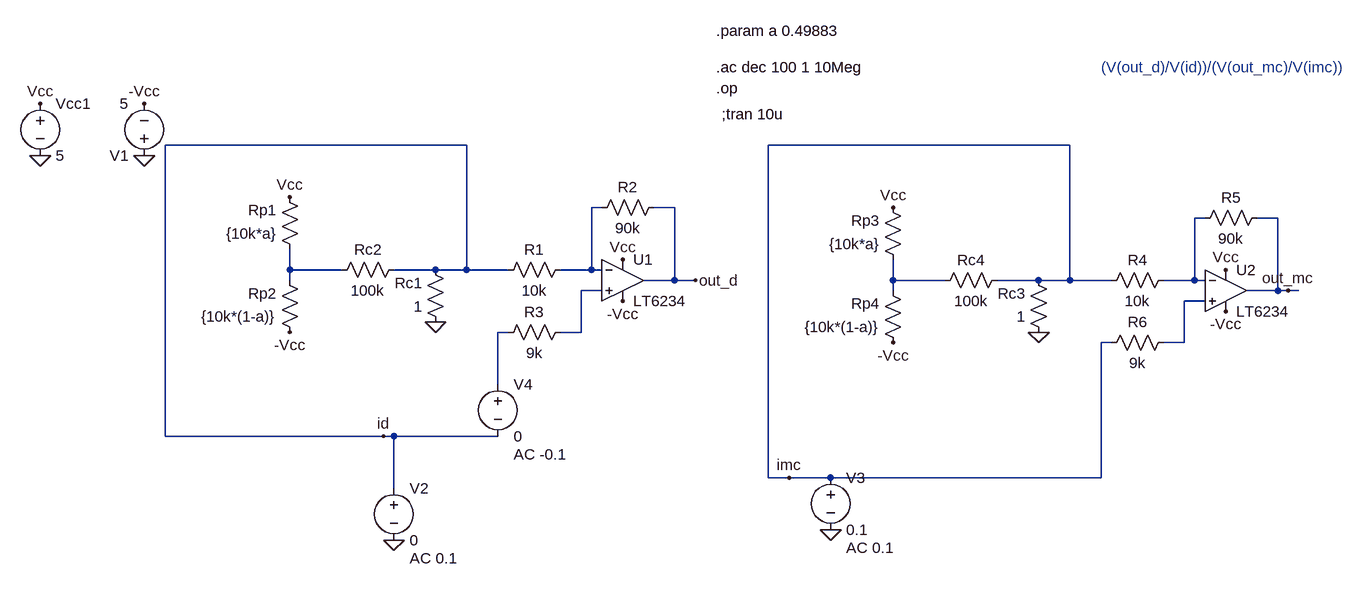
[diagram p0: schematic CMRR.asc]
CMRR.asc, the LTspice schematic file:
Version 4
SHEET 1 1748 796
WIRE 64 144 -400 144
WIRE 992 144 528 144
WIRE 272 240 256 240
WIRE 384 240 352 240
WIRE 1200 256 1184 256
WIRE 1312 256 1280 256
WIRE -208 336 -208 304
WIRE -128 336 -208 336
WIRE 16 336 -48 336
WIRE 64 336 64 144
WIRE 64 336 16 336
WIRE 128 336 64 336
WIRE 256 336 256 240
WIRE 256 336 208 336
WIRE 272 336 256 336
WIRE -208 352 -208 336
WIRE 384 352 384 240
WIRE 384 352 336 352
WIRE 416 352 384 352
WIRE 720 352 720 320
WIRE 800 352 720 352
WIRE 944 352 880 352
WIRE 992 352 992 144
WIRE 992 352 944 352
WIRE 1056 352 992 352
WIRE 1184 352 1184 256
WIRE 1184 352 1136 352
WIRE 1200 352 1184 352
WIRE 272 368 240 368
WIRE 720 368 720 352
WIRE 1312 368 1312 256
WIRE 1312 368 1264 368
WIRE 1328 368 1312 368
WIRE 1344 368 1328 368
WIRE 1200 384 1168 384
WIRE 128 432 112 432
WIRE 240 432 240 368
WIRE 240 432 208 432
WIRE 1056 448 1040 448
WIRE 1168 448 1168 384
WIRE 1168 448 1136 448
WIRE 112 512 112 432
WIRE -400 592 -400 144
WIRE -64 592 -400 592
WIRE -48 592 -64 592
WIRE 112 592 -48 592
WIRE 528 656 528 144
WIRE 560 656 528 656
WIRE 624 656 560 656
WIRE 1040 656 1040 448
WIRE 1040 656 624 656
WIRE -48 672 -48 592
FLAG -592 160 0
FLAG -432 160 0
FLAG -592 80 Vcc
FLAG -432 80 -Vcc
FLAG 304 320 Vcc
FLAG 304 384 -Vcc
FLAG 16 416 0
FLAG -208 224 Vcc
FLAG -208 432 -Vcc
FLAG 1232 336 Vcc
FLAG 1232 400 -Vcc
FLAG 944 432 0
FLAG 720 240 Vcc
FLAG 720 448 -Vcc
FLAG 1328 368 out_mc
FLAG 624 736 0
FLAG 560 656 imc
FLAG -48 752 0
FLAG 416 352 out_d
FLAG -64 592 id
SYMBOL voltage -592 64 R0
WINDOW 123 0 0 Left 0
WINDOW 39 0 0 Left 0
SYMATTR InstName Vcc1
SYMATTR Value 5
SYMBOL voltage -432 176 R180
WINDOW 123 0 0 Left 0
WINDOW 39 0 0 Left 0
SYMATTR InstName V1
SYMATTR Value 5
SYMBOL OpAmps\\LT6234 304 352 R0
SYMATTR InstName U1
SYMBOL res 224 320 R90
WINDOW 0 0 56 VBottom 2
WINDOW 3 32 56 VTop 2
SYMATTR InstName R1
SYMATTR Value 10k
SYMBOL res 368 224 R90
WINDOW 0 0 56 VBottom 2
WINDOW 3 32 56 VTop 2
SYMATTR InstName R2
SYMATTR Value 90k
SYMBOL res 224 416 R90
WINDOW 0 0 56 VBottom 2
WINDOW 3 32 56 VTop 2
SYMATTR InstName R3
SYMATTR Value 9k
SYMBOL res 32 432 R180
WINDOW 0 36 76 Left 2
WINDOW 3 36 40 Left 2
SYMATTR InstName Rc1
SYMATTR Value 1
SYMBOL res -32 320 R90
WINDOW 0 0 56 VBottom 2
WINDOW 3 32 56 VTop 2
SYMATTR InstName Rc2
SYMATTR Value 100k
SYMBOL res -192 320 R180
WINDOW 0 36 76 Left 2
WINDOW 3 36 40 Left 2
SYMATTR InstName Rp1
SYMATTR Value {10k*a}
SYMBOL res -192 448 R180
WINDOW 0 36 76 Left 2
WINDOW 3 36 40 Left 2
SYMATTR InstName Rp2
SYMATTR Value {10k*(1-a)}
SYMBOL OpAmps\\LT6234 1232 368 R0
SYMATTR InstName U2
SYMBOL res 1152 336 R90
WINDOW 0 0 56 VBottom 2
WINDOW 3 32 56 VTop 2
SYMATTR InstName R4
SYMATTR Value 10k
SYMBOL res 1296 240 R90
WINDOW 0 0 56 VBottom 2
WINDOW 3 32 56 VTop 2
SYMATTR InstName R5
SYMATTR Value 90k
SYMBOL res 1152 432 R90
WINDOW 0 0 56 VBottom 2
WINDOW 3 32 56 VTop 2
SYMATTR InstName R6
SYMATTR Value 9k
SYMBOL res 960 448 R180
WINDOW 0 36 76 Left 2
WINDOW 3 36 40 Left 2
SYMATTR InstName Rc3
SYMATTR Value 1
SYMBOL res 896 336 R90
WINDOW 0 0 56 VBottom 2
WINDOW 3 32 56 VTop 2
SYMATTR InstName Rc4
SYMATTR Value 100k
SYMBOL res 736 336 R180
WINDOW 0 36 76 Left 2
WINDOW 3 36 40 Left 2
SYMATTR InstName Rp3
SYMATTR Value {10k*a}
SYMBOL res 736 464 R180
WINDOW 0 36 76 Left 2
WINDOW 3 36 40 Left 2
SYMATTR InstName Rp4
SYMATTR Value {10k*(1-a)}
SYMBOL voltage 624 640 R0
WINDOW 123 24 124 Left 2
WINDOW 39 0 0 Left 0
SYMATTR Value2 AC 0.1
SYMATTR InstName V3
SYMATTR Value 0.1
SYMBOL voltage -48 656 R0
WINDOW 123 24 124 Left 2
WINDOW 39 0 0 Left 0
SYMATTR Value2 AC 0.1
SYMATTR InstName V2
SYMATTR Value 0
SYMBOL voltage 112 496 R0
WINDOW 123 24 124 Left 2
WINDOW 39 0 0 Left 0
SYMATTR Value2 AC -0.1
SYMATTR InstName V4
SYMATTR Value 0
TEXT 448 24 Left 2 !.ac dec 100 1 10Meg
TEXT 448 56 Left 2 !.op
TEXT 456 96 Left 2 !;tran 10u
TEXT 448 -32 Left 2 !.param a 0.49883
TEXT 1040 24 Left 2 ;(V(out_d)/V(id))/(V(out_mc)/V(imc))

The netlist it stands for:
* CMRR.asc
Vcc1 Vcc 0 5
V1 0 -Vcc 5
* U1: LT6234 (symbol OpAmps\LT6234 not available, pins judged from their places): In+=N005 In-=N001 V+=Vcc V-=-Vcc OUT=out_d
R1 N001 id 10k
R2 out_d N001 90k
R3 N005 N007 9k
Rc1 0 id 1
Rc2 id N003 100k
Rp1 N003 Vcc {10k*a}
Rp2 -Vcc N003 {10k*(1-a)}
* U2: LT6234 (symbol OpAmps\LT6234 not available, pins judged from their places): In+=N006 In-=N002 V+=Vcc V-=-Vcc OUT=out_mc
R4 N002 imc 10k
R5 out_mc N002 90k
R6 N006 imc 9k
Rc3 0 imc 1
Rc4 imc N004 100k
Rp3 N004 Vcc {10k*a}
Rp4 -Vcc N004 {10k*(1-a)}
V3 imc 0 0.1 AC 0.1
V2 id 0 0 AC 0.1
V4 N007 id 0 AC -0.1
.ac dec 100 1 10Meg
.op
;tran 10u
.param a 0.49883
* (V(out_d)/V(id))/(V(out_mc)/V(imc))
.backanno
.end